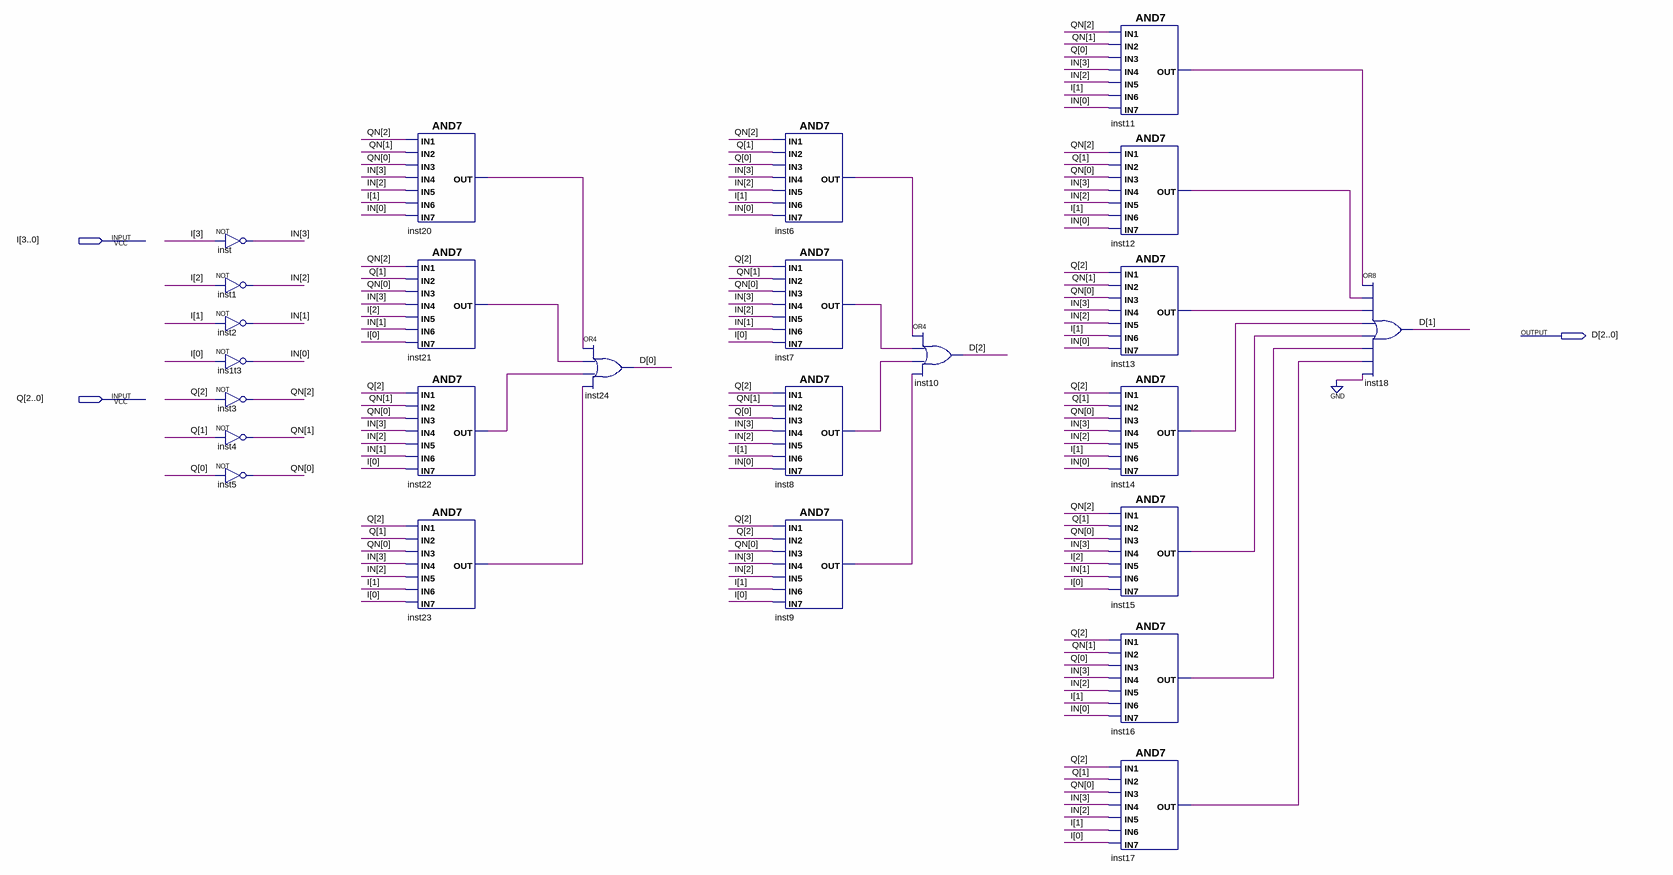
[diagram p0: schematic sheet]
// Quartus schematic NEXT_STATE.bdf as structural Verilog: 25 symbols, 3 pins
module NEXT_STATE (
  input  [3:0] I,
  input  [2:0] Q,
  output [2:0] D
);

  wire inst6_out, inst7_out, inst8_out, inst9_out, inst11_out, inst12_out, inst13_out, inst14_out,
       inst15_out, inst16_out, inst17_out, inst20_out, inst21_out, inst22_out, inst23_out;
  wire [2:0] QN;
  wire [3:0] IN;

  not inst (IN[3], I[3]);
  not inst1 (IN[2], I[2]);
  not inst2 (IN[1], I[1]);
  not ins1t3 (IN[0], I[0]);
  not inst3 (QN[2], Q[2]);
  not inst4 (QN[1], Q[1]);
  not inst5 (QN[0], Q[0]);
  and inst20 (inst20_out, QN[2], QN[1], QN[0], IN[3], IN[2], I[1], IN[0]);
  and inst21 (inst21_out, QN[2], Q[1], QN[0], IN[3], I[2], IN[1], I[0]);
  and inst22 (inst22_out, Q[2], QN[1], QN[0], IN[3], IN[2], IN[1], I[0]);
  and inst23 (inst23_out, Q[2], Q[1], QN[0], IN[3], IN[2], I[1], I[0]);
  or inst24 (D[0], inst20_out, inst21_out, inst22_out, inst23_out);
  and inst6 (inst6_out, QN[2], Q[1], Q[0], IN[3], IN[2], I[1], IN[0]);
  and inst7 (inst7_out, Q[2], QN[1], QN[0], IN[3], IN[2], IN[1], I[0]);
  and inst8 (inst8_out, Q[2], QN[1], Q[0], IN[3], IN[2], I[1], IN[0]);
  and inst9 (inst9_out, Q[2], Q[2], QN[0], IN[3], IN[2], I[1], I[0]);
  or inst10 (D[2], inst6_out, inst7_out, inst8_out, inst9_out);
  and inst11 (inst11_out, QN[2], QN[1], Q[0], IN[3], IN[2], I[1], IN[0]);
  and inst12 (inst12_out, QN[2], Q[1], QN[0], IN[3], IN[2], I[1], IN[0]);
  and inst13 (inst13_out, Q[2], QN[1], QN[0], IN[3], IN[2], I[1], IN[0]);
  and inst14 (inst14_out, Q[2], Q[1], QN[0], IN[3], IN[2], I[1], IN[0]);
  and inst15 (inst15_out, QN[2], Q[1], QN[0], IN[3], I[2], IN[1], I[0]);
  and inst16 (inst16_out, Q[2], QN[1], Q[0], IN[3], IN[2], I[1], IN[0]);
  and inst17 (inst17_out, Q[2], Q[1], QN[0], IN[3], IN[2], I[1], I[0]);
  or inst18 (D[1], inst11_out, inst12_out, inst13_out, inst14_out, inst15_out, inst16_out, inst17_out, 1'b0);
endmodule
